# Altium schematic sheet BV100011_ControlConnector.SchDoc
size B
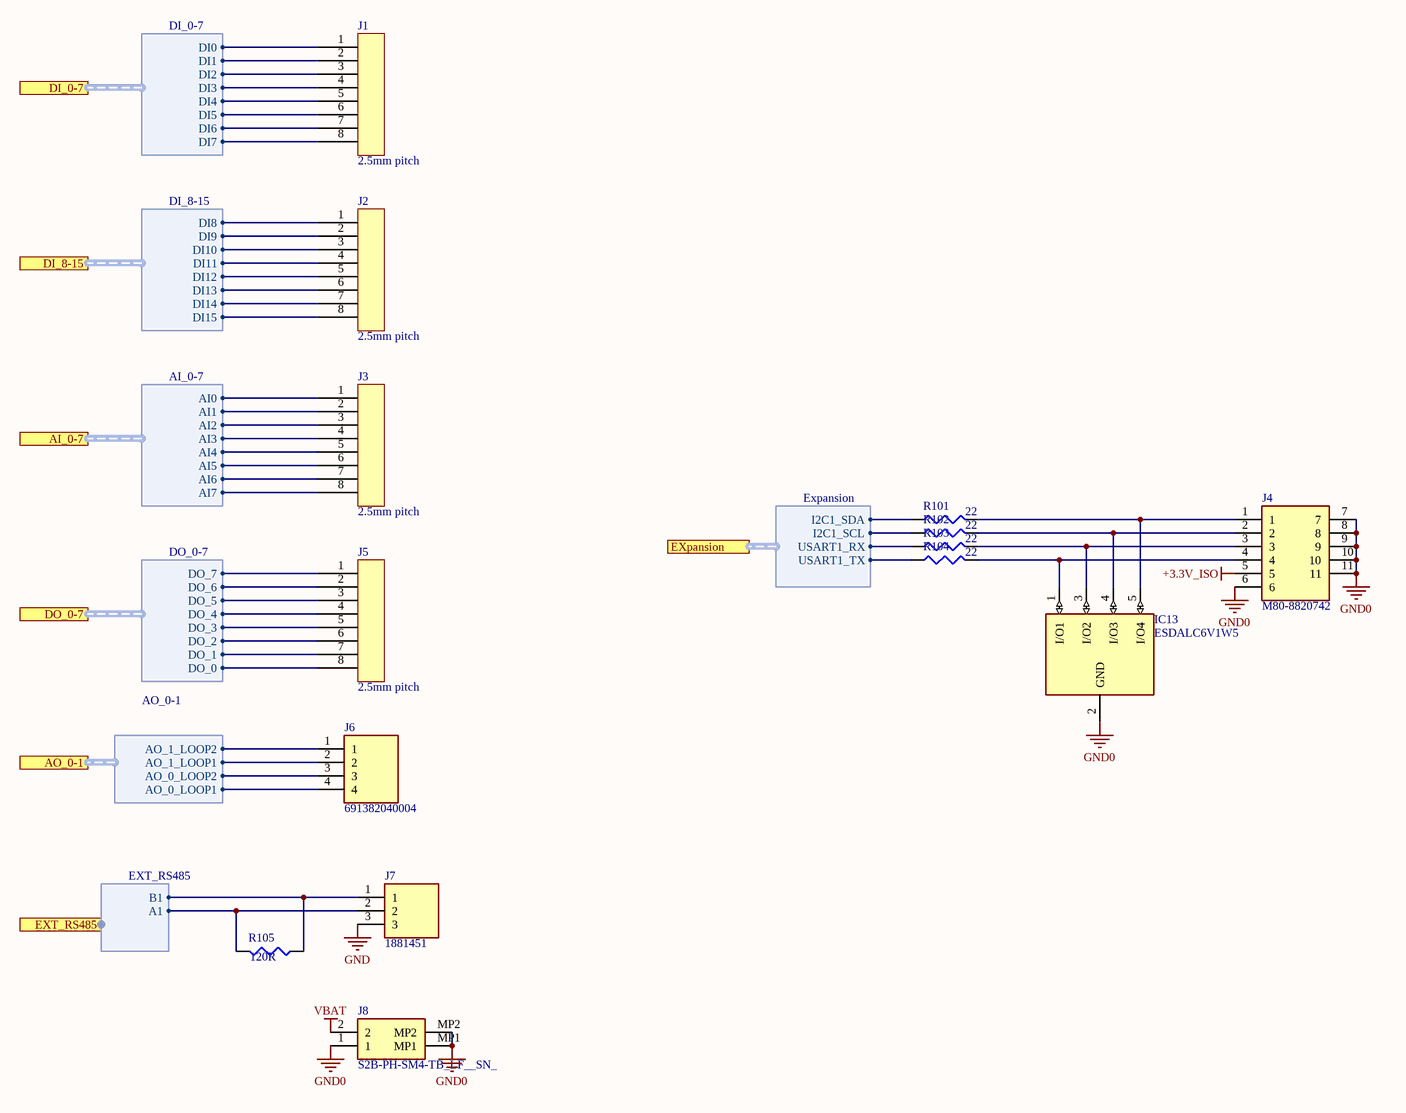
[diagram p0: BV100011_ControlConnector.SchDoc]

## Parts
IC13  ESDALC6V1W5  [SOT65P210X110-5N]
J1  2.5mm pitch  [2.5mm pitch]
J2  2.5mm pitch  [2.5mm pitch]
J3  2.5mm pitch  [2.5mm pitch]
J4  M80-8820742  [M80-8820742]
J5  2.5mm pitch  [2.5mm pitch]
J6  691382040004  [SHDRRA4W80P0X250_1X4_2200X1010X810P]
J7  1881451  [SHDR3W100P0X250_1X3_940X1010X810P]
J8  S2B-PH-SM4-TB_LF__SN_  [S2BPHSM4TBLFSN]
R101  22  [J1-0603]
R102  22  [J1-0603]
R103  22  [J1-0603]
R104  22  [J1-0603]
R105  120R  [14-1210]

## Ports
AI_0-7 (harness AI_0-7), AO_0-1 (harness AO_0-1), DI_0-7 (harness DI_0-7), DI_8-15 (harness DI_8-15), DO_0-7 (harness DO_0-7), EXpansion (harness Expansion), EXT_RS485 (harness EXT_RS485)

## Harnesses
DI_0-7: DI0, DI1, DI2, DI3, DI4, DI5, DI6, DI7
AI_0-7: AI0, AI1, AI2, AI3, AI4, AI5, AI6, AI7
DO_0-7: DO_7, DO_6, DO_5, DO_4, DO_3, DO_2, DO_1, DO_0
AO_0-1: AO_0_LOOP1, AO_0_LOOP2, AO_1_LOOP1, AO_1_LOOP2
EXT_RS485: A1, B1
DI_8-15: DI8, DI9, DI10, DI11, DI12, DI13, DI14, DI15
Expansion: I2C1_SDA, I2C1_SCL, USART1_RX, USART1_TX

## Nets
+3.3V_ISO: J4.5
GND: J7.3
GND0: IC13.2(GND) J4.6 J4.7 J4.8 J4.9 J4.10 J4.11 J8.1 J8.MP1 J8.MP2
VBAT: J8.2
NetIC13_1: IC13.1(I/O1) J4.4 R104.2
NetIC13_3: IC13.3(I/O2) J4.3 R103.2
NetIC13_4: IC13.4(I/O3) J4.2 R102.2
NetIC13_5: IC13.5(I/O4) J4.1 R101.2
NetJ1_1: J1.1 ; port DI_0-7.DI0
NetJ1_2: J1.2 ; port DI_0-7.DI1
NetJ1_3: J1.3 ; port DI_0-7.DI2
NetJ1_4: J1.4 ; port DI_0-7.DI3
NetJ1_5: J1.5 ; port DI_0-7.DI4
NetJ1_6: J1.6 ; port DI_0-7.DI5
NetJ1_7: J1.7 ; port DI_0-7.DI6
NetJ1_8: J1.8 ; port DI_0-7.DI7
NetJ2_1: J2.1 ; port DI_8-15.DI8
NetJ2_2: J2.2 ; port DI_8-15.DI9
NetJ2_3: J2.3 ; port DI_8-15.DI10
NetJ2_4: J2.4 ; port DI_8-15.DI11
NetJ2_5: J2.5 ; port DI_8-15.DI12
NetJ2_6: J2.6 ; port DI_8-15.DI13
NetJ2_7: J2.7 ; port DI_8-15.DI14
NetJ2_8: J2.8 ; port DI_8-15.DI15
NetJ3_1: J3.1 ; port AI_0-7.AI0
NetJ3_2: J3.2 ; port AI_0-7.AI1
NetJ3_3: J3.3 ; port AI_0-7.AI2
NetJ3_4: J3.4 ; port AI_0-7.AI3
NetJ3_5: J3.5 ; port AI_0-7.AI4
NetJ3_6: J3.6 ; port AI_0-7.AI5
NetJ3_7: J3.7 ; port AI_0-7.AI6
NetJ3_8: J3.8 ; port AI_0-7.AI7
NetJ5_1: J5.1 ; port DO_0-7.DO_7
NetJ5_2: J5.2 ; port DO_0-7.DO_6
NetJ5_3: J5.3 ; port DO_0-7.DO_5
NetJ5_4: J5.4 ; port DO_0-7.DO_4
NetJ5_5: J5.5 ; port DO_0-7.DO_3
NetJ5_6: J5.6 ; port DO_0-7.DO_2
NetJ5_7: J5.7 ; port DO_0-7.DO_1
NetJ5_8: J5.8 ; port DO_0-7.DO_0
NetJ6_1: J6.1 ; port AO_0-1.AO_1_LOOP2
NetJ6_2: J6.2 ; port AO_0-1.AO_1_LOOP1
NetJ6_3: J6.3 ; port AO_0-1.AO_0_LOOP2
NetJ6_4: J6.4 ; port AO_0-1.AO_0_LOOP1
NetJ7_1: J7.1 R105.1 ; port EXT_RS485.B1
NetJ7_2: J7.2 R105.2 ; port EXT_RS485.A1
NetR101_1: R101.1 ; port EXpansion.I2C1_SDA
NetR102_1: R102.1 ; port EXpansion.I2C1_SCL
NetR103_1: R103.1 ; port EXpansion.USART1_RX
NetR104_1: R104.1 ; port EXpansion.USART1_TX

## Library data of the parts
IC13 = ESDALC6V1W5: Integrated Circuit; Manufacturer_Name: STMicroelectronics; Allied_Number: 70389952; Datasheet Link: http://www.st.com/web/en/resource/technical/document/datasheet/CD00002946.pdf; Height: 1.1mm; Manufacturer_Part_Number: ESDALC6V1W5; Mouser Part Number: 511-ESDALC6V1W5; Mouser Price/Stock: https://www.mouser.com/Search/Refine.aspx?Keyword=511-ESDALC6V1W5; RS Part Number: 0250044P; RS Price/Stock: http://uk.rs-online.com/web/p/products/0250044P; Allied Price/Stock: http://www.alliedelec.com/stmicroelectronics-esdalc6v1w5/70389952/
J1-J3 J5 = 2.5mm pitch: 1881503
J4 = M80-8820742: Connector; Manufacturer_Name: Harwin; Datasheet Link: https://cdn.harwin.com/pdfs/M80-882.pdf; Manufacturer_Part_Number: M80-8820742; Mouser Part Number: 855-M80-8820742; Mouser Price/Stock: https://www.mouser.com/Search/Refine.aspx?Keyword=855-M80-8820742
J6 = 691382040004: Connector; Manufacturer_Name: Wurth Elektronik; Datasheet Link: https://www.we-online.com/catalog/datasheet/691382040004.pdf; Height: 8.1mm; Manufacturer_Part_Number: 691382040004; Mouser Part Number: 710-691382040004; Mouser Price/Stock: https://www.mouser.com/Search/Refine.aspx?Keyword=710-691382040004
J7 = 1881451: Connector; Manufacturer_Name: Phoenix Contact; Datasheet Link: https://componentsearchengine.com/Datasheets/1/1881451.pdf; Height: 8.1mm; Manufacturer_Part_Number: 1881451; Mouser Part Number: 651-1881451; Mouser Price/Stock: https://www.mouser.com/Search/Refine.aspx?Keyword=651-1881451; RS Part Number: 3579543; RS Price/Stock: https://uk.rs-online.com/web/p/products/3579543
J8 = S2B-PH-SM4-TB_LF__SN_: Connector; Manufacturer_Name: JST Sales America; Manufacturer_Part_Number: S2B-PH-SM4-TB(LF)(SN); Datasheet Link: https://www.jst-mfg.com/product/pdf/eng/ePH.pdf; Height: 6.6mm
R101-R105 = Res3: Resistor; Published: 8-Jun-2000; LatestRevisionDate: 29-May-2009; LatestRevisionNote: IPC-7351 Footprint Added.; PackageReference: J1-0603; Publisher: Altium Limited; PackageDescription: Chip Resistor
  R101-R104: Value: 22
  R105: Value: 120R